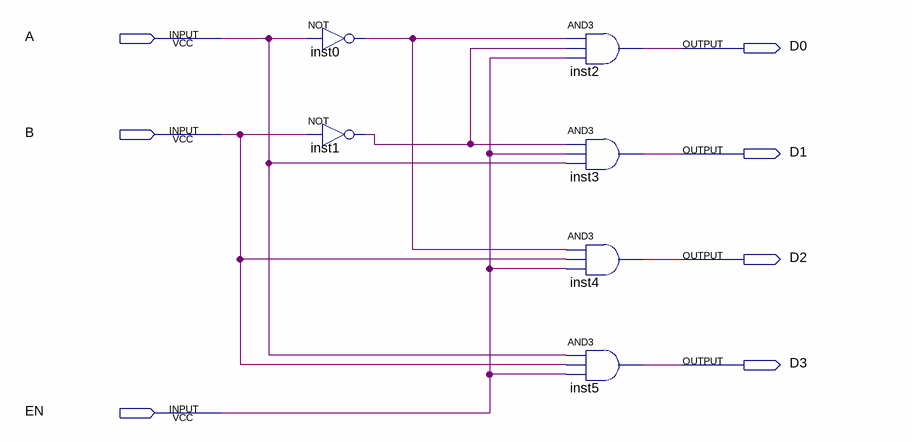
[diagram p0: schematic sheet]
// Quartus schematic decoder_2x4.bdf as structural Verilog: 6 symbols, 7 pins
module decoder_2x4 (
  input  A,
  input  B,
  input  EN,
  output D0,
  output D1,
  output D2,
  output D3
);

  wire inst0_out, inst1_out;

  not inst0 (inst0_out, A);
  not inst1 (inst1_out, B);
  and inst2 (D0, inst0_out, inst1_out, EN);
  and inst3 (D1, inst1_out, EN, A);
  and inst4 (D2, inst0_out, B, EN);
  and inst5 (D3, A, B, EN);
endmodule
